# Altium schematic sheet S-GRAFENO.SchDoc: SENSOR RESISTIVO DE GRAFENO
size A3; ApprovedBy: ---; Author: MARIO DE MIGUEL; SheetNumber: 5; SheetTotal: 7; ProjectTitle: SENSACIONAL 2
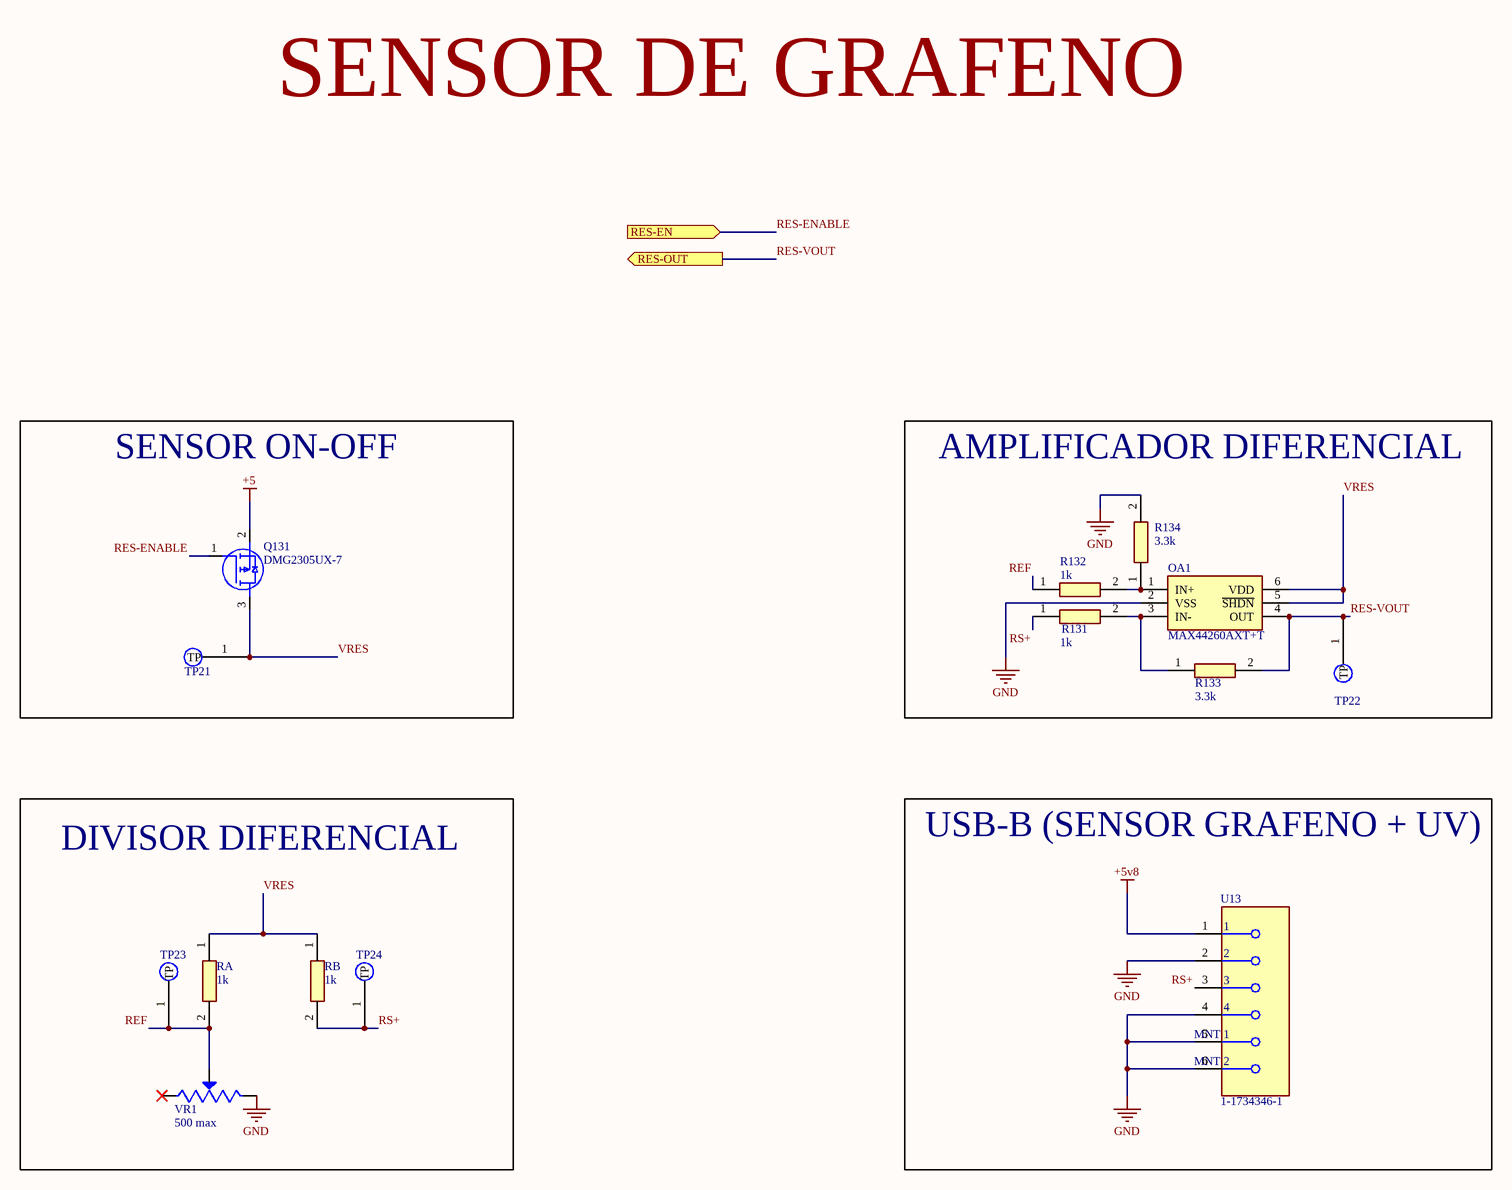
[diagram p0: S-GRAFENO.SchDoc]

## Parts
OA1  MAX44260AXT+T  [SOT65P218X110-6N]
Q131  DMG2305UX-7  [SOT96P240X115-3N]
R131  1k  [ERA6AEB101V]
R132  1k  [ERA6AEB101V]
R133  3.3k  [ERJP06D1000V]
R134  3.3k  [ERJP06D1000V]
RA  1k  [ERA6AEB101V]
RB  1k  [ERA6AEB101V]
TP21  Testpoint  [Testpoint_TH]  (value not drawn)  (no BOM)
TP22  Testpoint  [Testpoint_TH]  (value not drawn)  (no BOM)
TP23  Testpoint  [Testpoint_TH]  (value not drawn)  (no BOM)
TP24  Testpoint  [Testpoint_TH]  (value not drawn)  (no BOM)
U13  1-1734346-1  [FP-1-1734346-1-MFG]  (no BOM)
VR1  500 max  [TRIM_3296W-1-501LF]  (no BOM)

## Blocks framed on the sheet
SENSOR ON-OFF: Q131 TP21
AMPLIFICADOR DIFERENCIAL: OA1 R131-R134 TP22
DIVISOR DIFERENCIAL: RA RB TP23 TP24 VR1
USB-B (SENSOR GRAFENO + UV): U13

## Ports
RES-EN (in), RES-OUT (out)

## Nets
+5: Q131.2(S)
+5v8: U13.1
GND: OA1.2(VSS) R134.2 U13.2 U13.4 U13.5(MNT_1) U13.6(MNT_2) VR1.3(CW)
REF: R132.1 RA.2 TP23.1(TP) VR1.2(WIPER)
RES-ENABLE: Q131.1(G) ; port RES-EN
RES-VOUT: OA1.4(OUT) R133.2 TP22.1(TP) ; port RES-OUT
RS+: R131.1 RB.2 TP24.1(TP) U13.3
VRES: OA1.5(~{SHDN}) OA1.6(VDD) Q131.3(D) RA.1 RB.1 TP21.1(TP)
NetOA1_1: OA1.1(IN+) R132.2 R134.1
NetOA1_3: OA1.3(IN-) R131.2 R133.1

Not connected (* = marked no-connect by the designer): VR1 1(CCW)*

## Notes on the sheet
- SENSOR DE GRAFENO
- Title:
- Author:
- Approved:
- Size:
- Date:
- Git Hash:
- A3
- Prj:
- SW Version:
- Variant:
- Edited:
- CERN-OHL-S-2.0
- File:

## Library data of the parts
OA1 = MAX44260AXT+T: Integrated Circuit; Manufacturer_Name: Analog Devices; Datasheet Link: https://pdfserv.maximintegrated.com/en/ds/MAX44259-MAX44263.pdf; Height: 1.1mm; Manufacturer_Part_Number: MAX44260AXT+T; Mouser Part Number: 700-MAX44260AXT+T; Mouser Price/Stock: https://www.mouser.co.uk/ProductDetail/Maxim-Integrated/MAX44260AXT%2bT?qs=tT6YvvQkxszvTwG8U%2F9kvw%3D%3D
Q131 = DMG2305UX-7: MOSFET (P-Channel); Manufacturer_Name: Diodes Incorporated; Datasheet Link: https://www.diodes.com//assets/Datasheets/DMG2305UX.pdf; Height: 1.15mm; Manufacturer_Part_Number: DMG2305UX-7; Mouser Part Number: 621-DMG2305UX-7; Mouser Price/Stock: https://www.mouser.co.uk/ProductDetail/Diodes-Incorporated/DMG2305UX-7?qs=L1DZKBg7t5F%2FNBHrjfxC%252Bg%3D%3D; Arrow Part Number: DMG2305UX-7; Arrow Price/Stock: https://www.arrow.com/en/products/dmg2305ux-7/diodes-incorporated?utm_currency=USD&region=nac
R131 R132 RA RB = ERA-6ARW102V: Resistor; Manufacturer_Name: Panasonic; Datasheet Link: https://industrial.panasonic.com/cdbs/www-data/pdf/RDM0000/AOA0000C307.pdf; Height: 0.6mm; Manufacturer_Part_Number: ERA-6ARW102V; Mouser Part Number: 667-ERA-6ARW102V; Mouser Price/Stock: https://www.mouser.co.uk/ProductDetail/Panasonic/ERA-6ARW102V?qs=ob%252BdNz2%252BYEgF8szbcT859A%3D%3D
R133 R134 = ERJ-P06D3301V: Resistor; Manufacturer_Name: Panasonic; Datasheet Link: http://industrial.panasonic.com/cdbs/www-data/pdf/RDA0000/AOA0000C102.pdf; Height: 0.7mm; Manufacturer_Part_Number: ERJ-P06D3301V
U13 = CMP-03360-000002-1: CONN RCPT USB2.0 TYPEB 4P SMD RA; Manufacturer: TE; Conn Orientation: Right Angle; Shielding: true; Number Of Contacts: 4; Voltage Rating: 30V; Standoff Height: 0mm; Current Rating: 1A; Is Female: yes; Pitch: 1.25mm; Digikey Description: CONN RCPT USB2.0 TYPEB 4P SMD RA; Mouser Description: USB Connectors R/A SMT B W/post BLK; RoHS: TRUE; Temperature Range Low: 0°C; Automotive: No; Device Class L3: unset; Manufacturer Part Number: 1-1734346-1; Contact Material: Gold,Nickel; Temperature: 0°C to +50°C; ComponentLink2Description: Datasheet; Octopart: https://octopart.com/1-1734346-1-te+connectivity-43171491; Device Class L2: USB Connectors; Device Class L1: Connectors; Height: 11.25mm; Usb Standard: USB 2.0; ComponentLink2URL: https://upverter.com/datasheet/fa2984cd0f06f842a1fb894b40a37fa21ddb7ad0.pdf; Package: 1-1734346-1; Lead Free: Yes; Temperature Range High: +50°C; Category: Conn
VR1 = 3296W-1-501LF: Recortador, Cermet, Descanso 500 Ohms, PCB, 25 Vueltas, Pwr-Rtg 0.5W | Bourns 3296W-1-501LF; SnapEDA_Link: https://www.snapeda.com/parts/3296W-1-501LF/Bourns/view-part/?ref=snap; Package: NON STANDARD-3 Bourns; Value: *; MF: Bourns; MP: 3296W-1-501LF; Check_prices: https://www.snapeda.com/parts/3296W-1-501LF/Bourns/view-part/?ref=eda